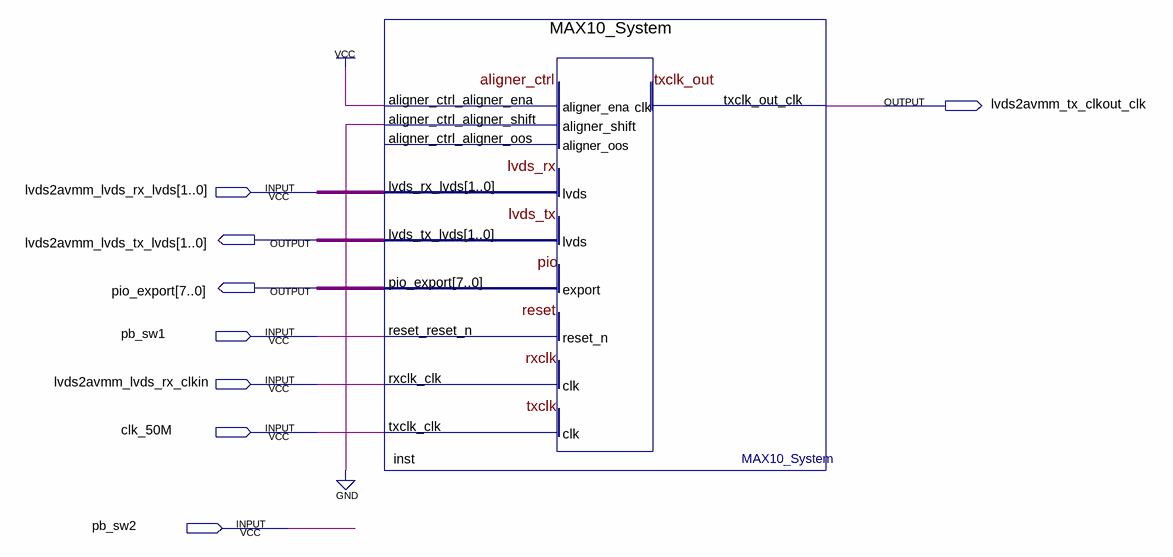
[diagram p0: schematic sheet]
// Quartus schematic Max10_LVDS2AVMM.bdf as structural Verilog: 1 symbols, 8 pins
module Max10_LVDS2AVMM (
  input  [1:0] lvds2avmm_lvds_rx_lvds,
  input  pb_sw1,
  input  lvds2avmm_lvds_rx_clkin,
  input  clk_50M,
  input  pb_sw2,
  output lvds2avmm_tx_clkout_clk,
  output [1:0] lvds2avmm_lvds_tx_lvds,
  output [7:0] pio_export
);

  MAX10_System inst (
    .aligner_ctrl_aligner_ena(1'b1), .aligner_ctrl_aligner_shift(1'b0),
    .lvds_rx_lvds(lvds2avmm_lvds_rx_lvds), .reset_reset_n(pb_sw1), .rxclk_clk(lvds2avmm_lvds_rx_clkin),
    .txclk_clk(clk_50M), .lvds_tx_lvds(lvds2avmm_lvds_tx_lvds), .pio_export(pio_export),
    .txclk_out_clk(lvds2avmm_tx_clkout_clk));  // open: aligner_ctrl_aligner_oos
endmodule
